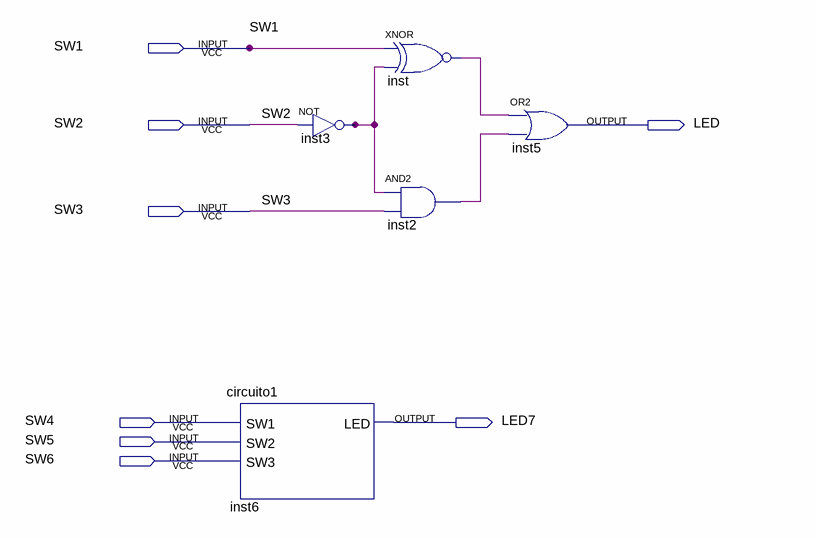
[diagram p0: schematic sheet]
// Quartus schematic Block1.bdf as structural Verilog: 5 symbols, 8 pins
module Block1 (
  input  SW1,
  input  SW2,
  input  SW3,
  input  SW4,
  input  SW5,
  input  SW6,
  output LED,
  output LED7
);

  wire inst2_out, inst3_out, inst_out;

  circuito1 inst6 (.SW1(SW4), .SW2(SW5), .SW3(SW6), .LED(LED7));
  not inst3 (inst3_out, SW2);
  xnor inst (inst_out, SW1, inst3_out);
  and inst2 (inst2_out, inst3_out, SW3);
  or inst5 (LED, inst_out, inst2_out);
endmodule
